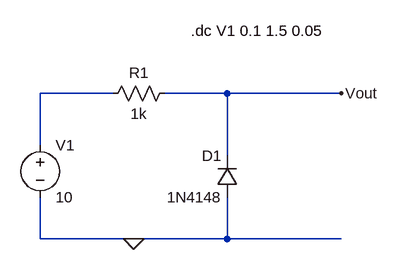
[diagram p0: schematic q3.asc]
q3.asc, the LTspice schematic file:
Version 4
SHEET 1 884 680
WIRE 176 224 64 224
WIRE 352 224 256 224
WIRE 528 224 352 224
WIRE 64 304 64 224
WIRE 352 320 352 224
WIRE 64 448 64 384
WIRE 208 448 64 448
WIRE 352 448 352 384
WIRE 352 448 208 448
WIRE 528 448 352 448
FLAG 528 224 Vout
FLAG 208 448 0
SYMBOL res 272 208 R90
WINDOW 0 0 56 VBottom 2
WINDOW 3 32 56 VTop 2
SYMATTR InstName R1
SYMATTR Value 1k
SYMBOL voltage 64 288 R0
SYMATTR InstName V1
SYMATTR Value 10
SYMBOL diode 368 384 R180
WINDOW 0 24 64 Left 2
WINDOW 3 24 0 Left 2
SYMATTR InstName D1
SYMATTR Value 1N4148
TEXT 296 128 Left 2 !.dc V1 0.1 1.5 0.05

The netlist it stands for:
* q3.asc
R1 Vout N001 1k
V1 N001 0 10
D1 0 Vout 1N4148
.model D D
.lib standard.dio
.dc V1 0.1 1.5 0.05
.backanno
.end